# Altium project STM32.PrjPcb
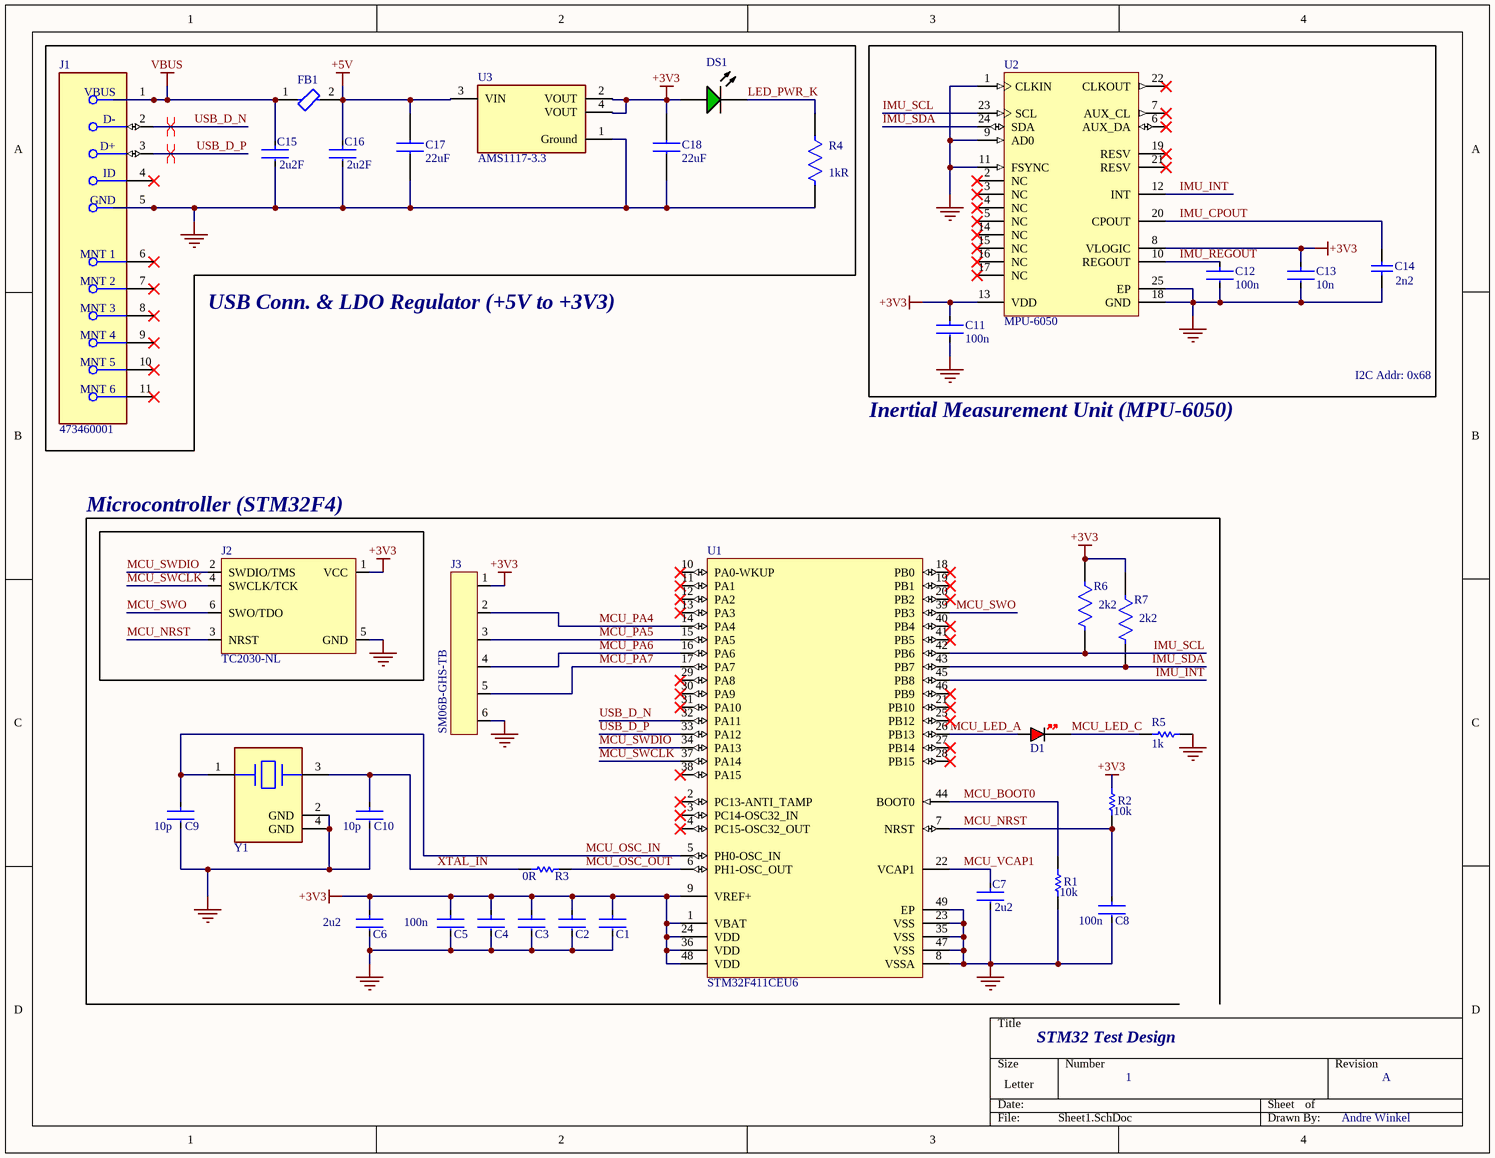
[diagram p0: Sheet1.SchDoc]
1 sheet, 35 parts. Net scope: global (net labels, ports and power ports of the same name join across sheets).
Board file: PCB1.PcbDoc

## Sheet Sheet1.SchDoc
size Letter; SheetNumber: 1; SheetTotal: 1

### Parts
C1  GCM155R71C104KA55D  [FP-GCM155-0_05-IPC_C]  (value not drawn)
C2  GCM155R71C104KA55D  [FP-GCM155-0_05-IPC_C]  (value not drawn)
C3  GCM155R71C104KA55D  [FP-GCM155-0_05-IPC_C]  (value not drawn)
C4  GCM155R71C104KA55D  [FP-GCM155-0_05-IPC_C]  (value not drawn)
C5  Capacitance: 100n  [FP-GCM155-0_05-IPC_C]  (hidden comment: GCM155R71C104KA55D)
C6  Capacitance: 2u2  [FP-CGA3E-0_3-0_1-IPC_C]  (hidden comment: CGA3E1X7S1C225K080AE)
C7  Capacitance: 2u2  [FP-CGA3E-0_3-0_1-IPC_C]  (hidden comment: CGA3E1X7S1C225K080AE)
C8  Capacitance: 100n  [FP-GCM155-0_05-IPC_C]  (hidden comment: GCM155R71C104KA55D)
C9  Capacitance: 10p  [FP-GJM033-0_03-IPC_B]  (hidden comment: GJM0335C1E100GB01D)
C10  Capacitance: 10p  [FP-GJM033-0_03-IPC_B]  (hidden comment: GJM0335C1E100GB01D)
C11  Capacitance: 100n  [FP-GCM155-0_05-IPC_C]  (hidden comment: GCM155R71C104KA55D)
C12  Capacitance: 100n  [FP-GCM155-0_05-IPC_C]  (hidden comment: GCM155R71C104KA55D)
C13  Capacitance: 10n  [FP-C0603-030-0_03-IPC_B]  (hidden comment: C0603X7R0J103K030BA)
C14  value 2n2  [CAPC1608X87X35NL15T15]  (hidden comment: C0603X222K5RACTU)
C15  Capacitance: 2u2F  [FP-CGA3E-0_3-0_1-IPC_C]  (hidden comment: CGA3E1X7S1C225K080AE)
C16  Capacitance: 2u2F  [FP-CGA3E-0_3-0_1-IPC_C]  (hidden comment: CGA3E1X7S1C225K080AE)
C17  Capacitance: 22uF  [C2012_Commercial]  (hidden comment: C2012X5R1C226M085AC)
C18  Capacitance: 22uF  [C2012_Commercial]  (hidden comment: C2012X5R1C226M085AC)
D1  RED  [LED_0402_RED]  (value not drawn)
DS1  HSMG-C170  [AVAG-HSMX-C170_V]  (value not drawn)
FB1  BLM31PG121SN1L  [FP-BLM31-0_2-t1_1-MFG]  (value not drawn)
J1  473460001  [FP-473460001-MFG]
J2  TC2030-NL  [TC2030-NL-FP]  (no BOM)
J3  SM06B-GHS-TB  [SM06B-GHS-TB]
R1  Resistance: 10k  [RESC0603X26X15LL03T05]  (hidden comment: CRG0201F10K)
R2  Resistance: 10k  [RESC0603X26X15LL03T05]  (hidden comment: CRG0201F10K)
R3  Resistance: 0R  [RESC1005X40X25LL05T05]  (hidden comment: ERJ2GE0R00X)
R4  Resistance: 1kR  [FP-AC0603-IPC_B]  (hidden comment: AC0603FR-071KL)
R5  Resistance: 1k  [RESC0603X26X15LL03T05]  (hidden comment: CRG0201F10K)
R6  value 2k2  [FP-CRGCQ0402-IPC_C]  (hidden comment: CRGCQ0402J2K2)
R7  value 2k2  [FP-CRGCQ0402-IPC_C]  (hidden comment: CRGCQ0402J2K2)
U1  STM32F411CEU6  [STM-UFQFPN48_L]
U2  MPU-6050  [IS-QFN-24_V]
U3  AMS1117-3.3  [FP-AMS1117-IPC_C]
Y1  ABM10AIG-24.000MHZ-2Z-T  [FP-ABM10AIG-MFG]  (value not drawn)

### Blocks framed on the sheet
I2C Addr: 0x68: C11-C14 U2

### Nets
+3V3: C1.1 C2.1 C3.1 C4.1 C5.1 C6.1 C11.1 C13.1 C18.1 DS1.1(A) J2.1(VCC) J3.1 R2.2 R6.1 R7.1 U1.1(VBAT) U1.9(VREF+) U1.24(VDD) U1.36(VDD) U1.48(VDD) U2.8(VLOGIC) U2.13(VDD) U3.2(VOUT) U3.4(VOUT)
+5V: C16.1 C17.1 FB1.2 U3.3(VIN)
GND: C1.2 C2.2 C3.2 C4.2 C5.2 C6.2 C7.2 C8.2 C9.2 C10.2 C11.2 C12.2 C13.2 C14.2 C15.2 C16.2 C17.2 C18.2 J1.5(GND) J2.5(GND) J3.6 R1.1 R4.2 R5.1 U1.8(VSSA) U1.23(VSS) U1.35(VSS) U1.47(VSS) U1.49(EP) U2.1(CLKIN) U2.9(AD0) U2.11(FSYNC) U2.18(GND) U2.25(EP) U3.1(Ground) Y1.2(GND) Y1.4(GND)
VBUS: C15.1 FB1.1 J1.1(VBUS)
IMU_CPOUT: C14.1 U2.20(CPOUT)
IMU_INT: U1.45(PB8) U2.12(INT)
IMU_REGOUT: C12.1 U2.10(REGOUT)
IMU_SCL: R6.2 U1.42(PB6) U2.23(SCL)
IMU_SDA: R7.2 U1.43(PB7) U2.24(SDA)
LED_PWR_K: DS1.2(K) R4.1
MCU_BOOT0: R1.2 U1.44(BOOT0)
MCU_LED_A: D1.A U1.26(PB13)
MCU_LED_C: D1.K R5.2
MCU_NRST: C8.1 J2.3(NRST) R2.1 U1.7(NRST)
MCU_OSC_IN: C9.1 U1.5(PH0-OSC_IN) Y1.1(1_Crystal)
MCU_OSC_OUT: R3.2 U1.6(PH1-OSC_OUT)
MCU_PA4: J3.2 U1.14(PA4)
MCU_PA5: J3.3 U1.15(PA5)
MCU_PA6: J3.4 U1.16(PA6)
MCU_PA7: J3.5 U1.17(PA7)
MCU_SWCLK: J2.4(SWCLK/TCK) U1.37(PA14)
MCU_SWDIO: J2.2(SWDIO/TMS) U1.34(PA13)
MCU_SWO: J2.6(SWO/TDO) U1.39(PB3)
MCU_VCAP1: C7.1 U1.22(VCAP1)
USB_D_N: J1.2(D-) U1.32(PA11)
USB_D_P: J1.3(D+) U1.33(PA12)
XTAL_IN: C10.1 R3.1 Y1.3(2_Crystal)

Not connected (* = marked no-connect by the designer): J1 4(ID)* 6(MNT_1)* 7(MNT_2)* 8(MNT_3)* 9(MNT_4)* 10(MNT_5)* 11(MNT_6)*; U1 2(PC13-ANTI_TAMP)* 3(PC14-OSC32_IN)* 4(PC15-OSC32_OUT)* 10(PA0-WKUP)* 11(PA1)* 12(PA2)* 13(PA3)* 18(PB0)* 19(PB1)* 20(PB2)* 21(PB10)* 25(PB12)* 27(PB14)* 28(PB15)* 29(PA8)* 30(PA9)* 31(PA10)* 38(PA15)* 40(PB4)* 41(PB5)* 46(PB9)*; U2 2(NC)* 3(NC)* 4(NC)* 5(NC)* 6(AUX_DA)* 7(AUX_CL)* 14(NC)* 15(NC)* 16(NC)* 17(NC)* 19(RESV)* 21(RESV)* 22(CLKOUT)*

### Layout directives
differential pair: USB_D_N, USB_D_P

### Notes on the sheet
- USB Conn. & LDO Regulator (+5V to +3V3)
- Inertial Measurement Unit (MPU-6050)
- Microcontroller (STM32F4)
- STM32 Test Design
- 1
- A
- Andre Winkel

### Library data of the parts
C1-C5 C8 C11 C12 = CMP-2008-03711-3: Ceramic Capacitor for Automotive 100nF ±10% 16VDC X7R 0402 Paper T/R; Voltage Rating (DC): 16V; Termination: SMD/SMT; Length: 1mm; Voltage: 16V; Mount: Surface Mount; Packaging: Tape and Reel; Case Code (Metric): 1005; Case/Package: 0402; Voltage Rating: 16V; Min Operating Temperature: -55°C; Case Code (Imperial): 0402; Ratings: AEC-Q200; Height: 0.5mm; Tolerance: 10%; Width: 0.02inch; Radiation Hardening: No; Depth: 0.5mm; Max Operating Temperature: 125°C; Package Quantity: 1; REACH SVHC: No SVHC; Thickness: 0.022inch; Dielectric: X7R; Lead Free: Lead Free
  C1-C4: Capacitance: 100nF
C6 C7 C15 C16 = CMP-08246-001138-1: Cap Ceramic 2.2uF 16V X7S 10% Pad SMD 0603 +125°C Automotive T/R; Tolerance: 10%; Mount: Surface Mount; Case/Package: 0603; Min Operating Temperature: -55°C; Packaging: Tape and Reel; Max Operating Temperature: 125°C; Thickness: 0.037inch; Voltage Rating: 16V; Ratings: AEC-Q200; Features: Soft Termination; Length: 0.063inch; Case Code (Metric): 1608; Width: 0.031inch; Case Code (Imperial): 0603
C9 C10 = CMP-06035-012709-1: Ceramic Capacitor 10pF ±2% 25V C0G 0201 (0603 Metric); Thickness: 300um; Package Quantity: 15000; Termination: SMD/SMT; Length: 0.6mm; Tolerance: 2%; Min Operating Temperature: -55°C; Case Code (Metric): 0603; Width: 0.3mm; Mount: Surface Mount; Resistor Type: Ceramic; Max Operating Temperature: 125°C; Packaging: Tape and Reel; Dielectric: C0G; Case/Package: 0201; Weight: 1.2E-05oz; Height: 0.3mm; Case Code (Imperial): 0201; Voltage Rating (DC): 25V
C13 = CMP-08246-006272-1: Multilayer Ceramic Capacitors 10nF ±10% 6.3V X7R SMD 0201; Dielectric Material: Ceramic; RoHS Compliant: Yes; Max Operating Temperature: 125°C; Case Code (Imperial): 0201; Width: 0.012inch; Depth: 0.3mm; Case Code (Metric): 0603; Resistor Type: Ceramic; Voltage Rating: 6.3V; Radiation Hardening: No; Mount: Surface Mount; Packaging: Tape and Reel; Number of Pins: 2; Series: C; Termination: Wraparound; Lead Free: Lead Free; Voltage Rating (DC): 6.3V; Min Operating Temperature: -55°C; Construction: Flat; Thickness: 0.013inch; Package Quantity: 1; Weight: 6E-06oz; Case/Package: 0201; Dielectric: X7R; Tolerance: 10%; Length: 0.6mm; Height: 0.3mm
C14 = CMP-2006-03302-1: Manufacturer: Kemet; Part Number: C0603X222K5RACTU
C17 C18 = C2012X5R1C226M085AC: Capacitor; Manufacturer_Name: TDK; Datasheet Link: https://product.tdk.com/system/files/dam/doc/product/capacitor/ceramic/mlcc/catalog/mlcc_commercial_general_en.pdf; Height: 0.75mm; Manufacturer_Part_Number: C2012X5R1C226M085AC; Mouser Part Number: 810-C2012X5R1C226MAC; Mouser Price/Stock: https://www.mouser.co.uk/ProductDetail/TDK/C2012X5R1C226M085AC?qs=6JAMGB%252BEdkx95FUmvIwfyQ%3D%3D; Arrow Part Number: C2012X5R1C226M085AC; Arrow Price/Stock: https://www.arrow.com/en/products/c2012x5r1c226m085ac/tdk
D1 = LED_0402_RED: LED 0402 RED SMD
DS1 = CMP-2000-05062-1: Chip LED, Green, 2.2 V, -40 to 85 degC, 2-Pin SMD, Pb-Free, Tape and Reel; Manufacturer: Avago; No. of Pins: 2; Peak Wavelength: 570nm; SVHC: NoSVHC(16-Jun-2014); Dominant Wavelength: 572nm; Forward Current If: 20mA; Viewing Angle: 170deg; Lens Shape: Rectangular; PIV Max: 5V; External Width: 1.25mm; LED Type: Standard; External Depth: 0.8mm; Opto Mounting Orientation: Top; Luminous Intensity: 15mcd; Luminous Intensity Min: 4mcd; Forward Voltage VF Max: 2.6V; External Length / Height: 2mm; Bulb Size: 1.25mmx1.4mm; Light Area Height: 1mm; Voltage Vf Typ: 2.2V; Operating Temperature Max: 85degC; Datasheet Version: Oct-08; MSL: MSL2A-4weeks; Peak Forward Current: 20mA; Package Description: 2-Pin Surface Mount Device, Body 2 x 1.25 mm, Height 0.8 mm; Datasheet URL: https://datasheet.ciiva.com/29280/180495-da-01-en-chip-led-hsmg-c170-gelb-gruen-29280971.pdf; Storage Temperature Min: -40degC; LED Colour: Green; Wavelength Typ: 570nm; Mounting Type: SMD; Forward Current If Max: 20mA; Dominant Wavelength Typ: 572nm; LED Mounting: SMD; Operating Temperature Range: -30degCto+85degC; Operating Temperature Min: -30degC; Manufacturer URL: http://www.avagotech.com/; Packaging: CutTape; Luminous Intensity Typ: 15mcd; Package Reference: HSMX-C170; Storage Temperature Max: 85degC; Opto Case Style: SMD; Forward Voltage: 2.2V
FB1 = CMP-0686-00732-3: Chip Ferrite Bead Array, 1206, 120Ω @ 100MHz, 0.02Ω, 25%, 3.5A; Number of Lines: 1; DC Current: 3A; Impedance: 120R; Material: Steel; DC Resistance (DCR): 20mR; Shielding: Unshielded; Number of Pins: 2; Case Code (Metric): 3216; Contact Plating: Tin; Radiation Hardening: No; Termination: SMD/SMT; Lead Free: Lead Free; Core Material: Ferrite; Case Code (Imperial): 1206; Test Frequency: 100MHz; Depth: 1.6mm; Max Operating Temperature: 125°C; Package Quantity: 3000; Packaging: Tape and Reel; Min Operating Temperature: -55°C; Length: 3.2mm; Current Rating: 3.5A; RoHS Compliant: Yes; Tolerance: 25%; Width: 1.6mm; Max Current Rating: 3.5A; Frequency: 100MHz; Military Standard: Not; Case/Package: 1206; Max DC Current: 3A; Height: 1.1mm
J1 = CMP-2000-05246-2: CONN RCPT USB2.0 MICRO B SMD R/A; Manufacturer: Molex; Conn Orientation: Right Angle; Is Female: yes; Shielding: true; Pitch: 0.65mm; Number Of Contacts: 5; Voltage Rating: 30V; Current Rating: 1.8A; Device Class L2: USB Connectors; Digikey Description: CONN RCPT USB2.0 MICRO B SMD R/A; Height: 2.945mm; RoHS: TRUE; ComponentLink2Description: Datasheet; Octopart: https://octopart.com/47346-0001-molex-7164928; Automotive: No; Package: 0; Category: Conn; Device Class L1: Connectors; Usb Standard: USB 2.0; Temperature: -30°C to +85°C; Temperature Range Low: -30°C; Footprint Url: https://www.molex.com/pdm_docs/sd/473460001_sd.pdf; ComponentLink2URL: https://www.molex.com/webdocs/datasheets/pdf/en-us/0473460001_IO_CONNECTORS.pdf; Lead Free: Yes; Manufacturer Part Number: 473460001; Contact Material: Gold,Nickel; Temperature Range High: +85°C; Device Class L3: unset
J2 = TC2030-NL: Tag-Connect No-Solder SWD Debug Connector (No Legs) DO NOT PLACE; Manufacturer: Tag-Connect; Manufacturer Part Number: TC2030-NL-FP
J3 = SM06B-GHS-TB: Header Connector 6 Position 1.25MM Pitch SMD Horizontal JST GH; Manufacturer: JST; Manufacturer Part Number: SM06B-GHS-TB
R1 R2 R5 = CMP-2004-03568-1: Manufacturer: TE Connectivity / AMP; Part Number: CRG0201F10K
R3 = CMP-2000-07451-1: Chip Resistor, 0 Ohm, 0.1 W, -55 to 155 degC, 0402 (1005 Metric), RoHS, Tape and Reel; Manufacturer: Panasonic; Voltage Rating (DC): 50V; Temperature Coefficient: 600ppm/��C; Max Power Dissipation: 100mW; Tolerance: 5%; Number of Terminations: 2; Mount: SurfaceMount; Height: 0.35mm; Packaging: TapeandReel; Contact Plating: Tin; Manufacturer URL: http://www.panasonic.com/; Composition: ThickFilm; Max Operating Temperature: 155degC; REACH SVHC: NoSVHC; Case/Package: 0402; Package Reference: 402; Depth: 0.5mm; Package Description: 2-Pin Surface Mount Device, Body 1 x 0.5 mm; Datasheet URL: https://industrial.panasonic.com/cdbs/www-data/pdf/RDA0000/AOA0000C301.pdf; RoHSCompliant: True; Case Code (Imperial): 0402; Military Standard: Not; Min Operating Temperature: -55degC; Power Rating: 100mW; Datasheet Version: 03/2015; Length: 1mm; Case Code (Metric): 1005; Termination: SMD/SMT; Mounting Technology: SurfaceMount; Voltage Rating: 50V; Width: 0.02inch; Package Quantity: 1; Lead Free: LeadFree; Radiation Hardening: No
R4 = CMP-2000-04828-3: RES 1kΩ 1.00% 0.1W 0603; Voltage Rating: 50V; Power Rating: 100mW; Tolerance: 1%; Temperature Coefficient: 100ppm/°C; Depth: 0.8mm; Case/Package: 0603; Size Code: 0603; Case Code (Metric): 1608; Height: 0.022inch; Series: AC; Width: 0.031inch; Construction: Rectangular; Length: 0.063inch; Case Code (Imperial): 0603; Package Quantity: 1; RoHS Compliant: Yes; Features: Moisture Resistant; Resistor Type: Thick Film; Max Power Dissipation: 100mW; Packaging: Tape and Reel; Termination: SMD/SMT; Ratings: AEC-Q200; Max Operating Temperature: 155°C; Min Operating Temperature: -55°C; Military Standard: Not; Lead Free: Lead Free; Number of Terminations: 2
R6 R7 = CMP-03211-006553-1: CRGCQ0402 2.2KΩ 5% ±100ppm/°C 50V; Manufacturer: TE Connectivity; Power Rating: 0.0625W; Tolerance: 0.05; RoHS: TRUE; Voltage Rating: 50V; Ipc Land Pattern Name: RESC10050X35; Resistance: 2.2KΩ; Temperature Range High: +155°C; Lead Free: Yes; Manufacturer Part Number: CRGCQ0402J2K2; ComponentLink2Description: Datasheet; Ambient Temperature Range High: +70°C; Automotive: Yes; Device Class L2: Resistors; Temperature Coefficient: ±100ppm/°C; Package: CRGCQ0402; Series: CRGCQ; Composition: Thick Film; Temperature Range Low: -55°C; Octopart: https://octopart.com/crgcq0402j2k2-te+connectivity-91018010; Temperature: -55°C to +155°C; Device Class L3: Chip SMD Resistors; ComponentLink2URL: https://www.te.com/commerce/DocumentDelivery/DDEController?Action=showdoc&DocId=Data+Sheet%7F1773204-3%7F1%7Fpdf%7FEnglish%7FENG_DS_1773204-3_1.pdf%7F4-2176347-767; Category: Res; Device Class L1: Passive Components; Height: 0.4mm
U1 = CMP-0243-00165-1: ARM Cortex-M4 32-bit MCU+FPU, 512 KB Flash, 128 KB RAM, 36 I/Os, 48-Pin UFQFPN, -40 to 85 degC, Tray; Operating Frequency(F) (Processor speed) (MHz): 100; FLASH Size (Prog) (kB): 512; Internal RAM Size (kB): 128; I/Os (High Current): 36; Supply Voltage(Vcc) min (V): 1.7; Package Reference: 48-Pin Ultra Thin Fine Pitch Quad Flat No-Lead, 7 x 7 x 0.6 mm Body, 0.5 mm Pitch, Exposed Pad; ComponentLink1Description: Manufacturer URL; ComponentLink1URL: http://www.st.com/; Packing: Tray; Package Description: UFQFPN48; Core: ARM Cortex-M4; ComponentLink2Description: Datasheet; ComponentLink2URL: http://www.st.com/st-web-ui/static/active/en/resource/technical/document/datasheet/DM00115249.pdf; DatasheetVersion: Rev. 6; Mounting Technology: Surface Mount
U2 = CMP-1753-00002-2: 3-Axis Gyroscope, Accelerometer and a Digital Motion Processor(TM) (DMP), 2.375 to 3.46 V, -40 to 85 degC, 24-Pin QFN, RoHS, Tape and Reel; Manufacturer: InvenSense; Featured Product: MPU-60506-Axis,IntegratedI²CSolution; Other Names: 1428-1007-2 / MPU6050; Sensor Type: MotionTracking; Online Catalog: MPU-6000™Series; Unit PriceUSD: Digital; Datasheet Version: Rev. 3.3, 05/2012; Category: Sensors,Transducers; Datasheet URL: http://datasheet.octopart.com/MPU-6050-InvenSense-datasheet-14421344.pdf; Family: Multifunction; Standard Package: 5,000; Manufacturer URL: http://www.invensense.com/; Output Type: Digital; Dynamic Catalog: MPU-6000™Series
U3 = CMP-209535-000001-1: LDO Voltage Regulators 1A, 3.3V; Manufacturer: Advanced Monolithic Systems; Dropout Voltage: 1.1V; Output Type: Fixed; Nominal Supply Current: 5mA; Max Power Dissipation: 1.2W; Max Supply Voltage: 15V; Number Of Outputs: 1; Standoff Height: 0.64mm; Max Junction Temp: +125°C; Height: 1.8mm; Package: AMS1117; Device Class L2: Power Management ICs; ComponentLink2Description: Datasheet; ComponentLink2URL: http://www.advanced-monolithic.com/pdf/ds1117.pdf; Category: IC; RoHS: TRUE; Automotive: No; Device Class L1: Integrated Circuits (ICs); Output Current: 1A; Device Class L3: Voltage Regulators - Linear; Temperature: -40°C to +125°C; Output Voltage: 3.3V; Manufacturer Part Number: AMS1117-3.3; Temperature Range Low: -40°C; Octopart: https://octopart.com/ams1117-3.3-advanced+monolithic+systems-25899300; Lead Free: Yes; Ipc Land Pattern Name: SOT229P700X180-4; Temperature Range High: +125°C
Y1 = CMP-27762-005365-1: Crystal 24MHz ±20ppm 10pF SMD-4 2.5mm x 2mm Automotive